# EAGLE design raspi3_nonHatv2 (EAGLE 9.4.1)
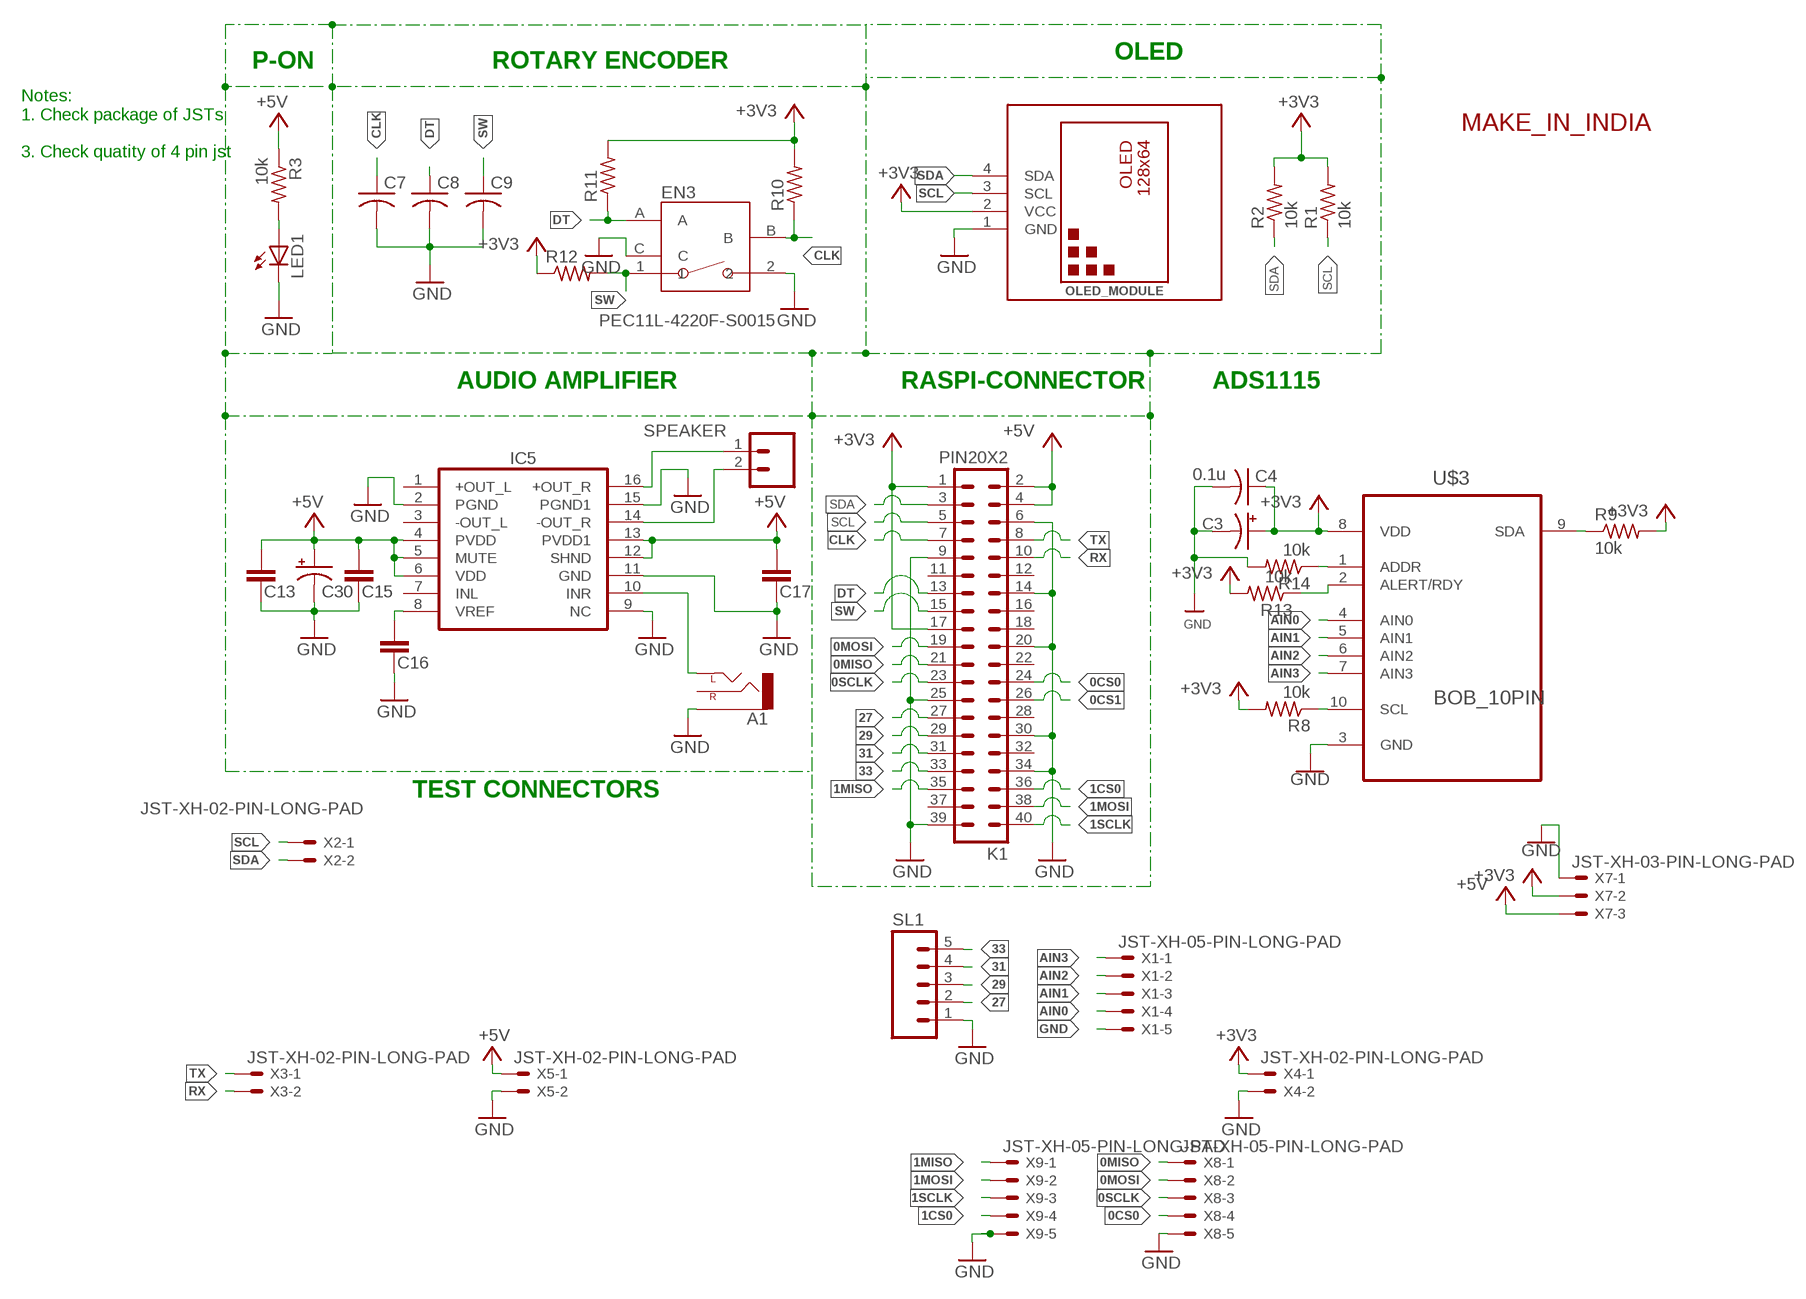
[diagram p0: schematic, sheet 1]

## Parts
A1  AUDIO-JACKPTH  [AUDIO-JACK]
C3  10u  CAP_POL_10V  [C/6032-28R]
C4  0.1u  CAP0805  [C0805]
C7  C-USC0603K  [C0603K]
C8  C-USC0603K  [C0603K]
C9  C-USC0603K  [C0603K]
C13  1uf  C-EUC1206  [C1206]
C15  1uf  C-EUC1206  [C1206]
C16  0.1uf  C-EUC1206  [C1206]
C17  1uf  C-EUC1206  [C1206]
C30  CAP_POL_10V  [C/6032-28R]
EN3  PEC11L-4220F-S0015  [PEC11L-4220F-S0015]
IC5  PAM8403  [SOP-16]
K1  PIN20X2  [PIN_20X2]
LED1  LED3MM  [LED3MM]
OLED_MODULE  DIY-MODULES_DISPLAY-OLED-128X64-I2C  [DIY-MODULES_DISPLAY-OLED-128X64-I2C]
R1  10k  RESISTOR0207/7  [0207/7]
R2  10k  RESISTOR0207/7  [0207/7]
R3  10k  RESISTOR0207/7  [0207/7]
R8  10k  RESISTOR0603  [R0603]
R9  10k  RESISTOR0603  [R0603]
R10  R-US_M0805  [M0805]
R11  R-US_M0805  [M0805]
R12  R-US_M0805  [M0805]
R13  10k  RESISTOR0603  [R0603]
R14  10k  RESISTOR0603  [R0603]
SL1  M05  [05P]
SPEAKER  M02  [02P]
U$1  MAKE-IN-INDIA-LOGO  [MAKE-IN-INDIA]
U$3  BOB_10PIN  [BOB10]
X1  JST-XH-05-PIN-LONG-PAD  [JST-XH-05-PACKAGE-LONG-PAD]
X2  JST-XH-02-PIN-LONG-PAD  [JST-XH-02-PACKAGE-LONG-PAD]
X3  JST-XH-02-PIN-LONG-PAD  [JST-XH-02-PACKAGE-LONG-PAD]
X4  JST-XH-02-PIN-LONG-PAD  [JST-XH-02-PACKAGE-LONG-PAD]
X5  JST-XH-02-PIN-LONG-PAD  [JST-XH-02-PACKAGE-LONG-PAD]
X7  JST-XH-03-PIN-LONG-PAD  [JST-XH-03-PACKAGE-LONG-PAD]
X8  JST-XH-05-PIN-LONG-PAD  [JST-XH-05-PACKAGE-LONG-PAD]
X9  JST-XH-05-PIN-LONG-PAD  [JST-XH-05-PACKAGE-LONG-PAD]

## Nets
0CS0: K1.24 X8.4
0CS1: K1.26
0MISO: K1.21 X8.1
0MOSI: K1.19 X8.2
0SCLK: K1.23 X8.3
1CS0: K1.36 X9.4
1MISO: K1.35 X9.1
1MOSI: K1.38 X9.2
1SCLK: K1.40 X9.3
27: K1.27 SL1.2
29: K1.29 SL1.3
31: K1.31 SL1.4
33: K1.33 SL1.5
+3V3: C3.+ C4.1 K1.1 K1.17 OLED_MODULE.2(VCC) R1.2 R2.2 R8.2 R9.2 R10.2 R11.2 R12.1 R13.2 U$3.8(VDD) X4.1 X7.2
+5V: C13.1 C15.2 C17.2 C30.+ IC5.4(PVDD) IC5.5(MUTE) IC5.6(VDD) IC5.12(SHND) IC5.13(PVDD1) K1.2 K1.4 R3.1 X5.1 X7.3
AIN0: U$3.4(AIN0) X1.4
AIN1: U$3.5(AIN1) X1.3
AIN2: U$3.6(AIN2) X1.2
AIN3: U$3.7(AIN3) X1.1
CLK: C7.1 EN3.B K1.7 R10.1
DT: C8.1 EN3.A K1.13 R11.1
GND: A1.SLEEVE C3.- C4.2 C7.2 C8.2 C9.2 C13.2 C15.1 C16.2 C17.1 C30.- EN3.2 EN3.C IC5.2(PGND) IC5.9(NC) IC5.11(GND) IC5.15(PGND1) K1.6 K1.9 K1.14 K1.20 K1.25 K1.30 K1.34 K1.39 LED1.K(C) OLED_MODULE.1(GND) R14.2 SL1.1 U$3.3(GND) X1.5 X4.2 X5.2 X7.1 X8.5 X9.5
N$1: LED1.A R3.2
N$4: IC5.16(+OUT_R) SPEAKER.1
N$12: R8.1 U$3.10(SCL)
N$13: R9.1 U$3.9(SDA)
N$14: R13.1 U$3.2(ALERT/RDY)
N$15: R14.1 U$3.1(ADDR)
N$27: IC5.14(-OUT_R) SPEAKER.2
N$29: A1.TIP(LEFT) IC5.10(INR)
N$34: C16.1 IC5.8(VREF)
RX: K1.10 X3.2
SCL: K1.5 OLED_MODULE.3(SCL) R1.1 X2.1
SDA: K1.3 OLED_MODULE.4(SDA) R2.1 X2.2
SW: C9.1 EN3.1 K1.15 R12.2
TX: K1.8 X3.1
Unconnected: A1.RING(RIGHT) IC5.1(+OUT_L) IC5.3(-OUT_L) IC5.7(INL) K1.11 K1.12 K1.16 K1.18 K1.22 K1.28 K1.32 K1.37

## Notes on the sheet
- OLED
- P-ON | ROTARY ENCODER
- Notes:
  1. Check package of JSTs
  
  3. Check quatity of 4 pin jst
- AUDIO AMPLIFIER | RASPI-CONNECTOR | ADS1115
- TEST CONNECTORS

## Library data of the parts
A1 = CEDT_JANUARY_2015_v5:AUDIO-JACK: 3.5mm Audio Jack Simple 3.5mm common PCB mount audio jack. SKU: PRT-08032
C3 = CEDT_JANUARY_2015_v5:CAP_POL
C4 = CEDT_JANUARY_2015_v5:CAP
C7-C9 = adafruit:C-US: CAPACITOR, American symbol
C13 C15-C17 = rcl:C-EU: CAPACITOR, European symbol
C30 = CEDT_SEPTEMBER_V2:CAP_POL
EN3 = Encoders:PEC11L-4220F-S0015: ROTARY ENCODER MECHANICAL 15PPR Manufacturer's datasheet <https://www.bourns.com/docs/Product-Datasheets/PEC11L.pdf>; CREATED_BY: PCBLayout.com; DIGIKEY_PARTNO: PEC11L-4220F-S0015-ND; MANUFACTURER: Bourns Inc.; MPN: PEC11L-4220F-S0015
IC5 = PAM8403:PAM8403: Dual channel audio amplifier IC - PAM8403
K1 = FLYFISH:PIN20X2
LED1 = CEDT_JANUARY_2015_v5:LED
OLED_MODULE = esp32_dev_kit_v14:DIY-MODULES_DISPLAY-OLED-128X64-I2C: 128x64 Dot Matrix OLED Module based on SSD1306 chip Variant with I2C interface More details available here: http://www.instructables.com/id/Monochrome-096-i2c-OLED-display-with-arduino-SSD13/ SSD1306 datasheet: https://cdn-shop.adafruit.com/datasheets/SSD1306.pdf Click here to find device on ebay.com <http://www.ebay.com/sch/oled+display+128x64+iic> Note: There are two variants: I2C and SPI. Search for the proper version.
R1-R3 = CEDT:RESISTOR; OC_FARNELL: unknown
R8 R9 R13 R14 = CEDT_JANUARY_2015_v5:RESISTOR
R10-R12 = rcl:R-US_: RESISTOR, American symbol; SPICEPREFIX: R
SL1 = con-amp-quick:M05: AMP QUICK CONNECTOR; OC_FARNELL: unknown; OC_NEWARK: unknown
SPEAKER = CEDT_JANUARY_2015_v5:M02: AMP QUICK CONNECTOR
U$1 = namanpuri:MAKE-IN-INDIA-LOGO
U$3 = CEDT_JANUARY_2015_v5:BOB_10PIN
X1 X8 X9 = Rembrandt Electronics - JST XH Connectors v1-0:JST-XH-05-PIN: JST XH Connector 2 Pin Wire to board connector. Pitch: 2,54 mm, (0.100") Number of pins: 5 Created by Rembrandt Electronics www.rembrandtelectronics.com
X2-X5 = Rembrandt Electronics - JST XH Connectors v1-0:JST-XH-02-PIN: JST XH Connector 2 Pin Wire to board connector. Pitch: 2,54 mm, (0.100") Number of pins: 2 Created by Rembrandt Electronics www.rembrandtelectronics.com
X7 = Rembrandt Electronics - JST XH Connectors v1-0:JST-XH-03-PIN: JST XH Connector 2 Pin Wire to board connector. Pitch: 2,54 mm, (0.100") Number of pins: 3 Created by Rembrandt Electronics www.rembrandtelectronics.com

## Board
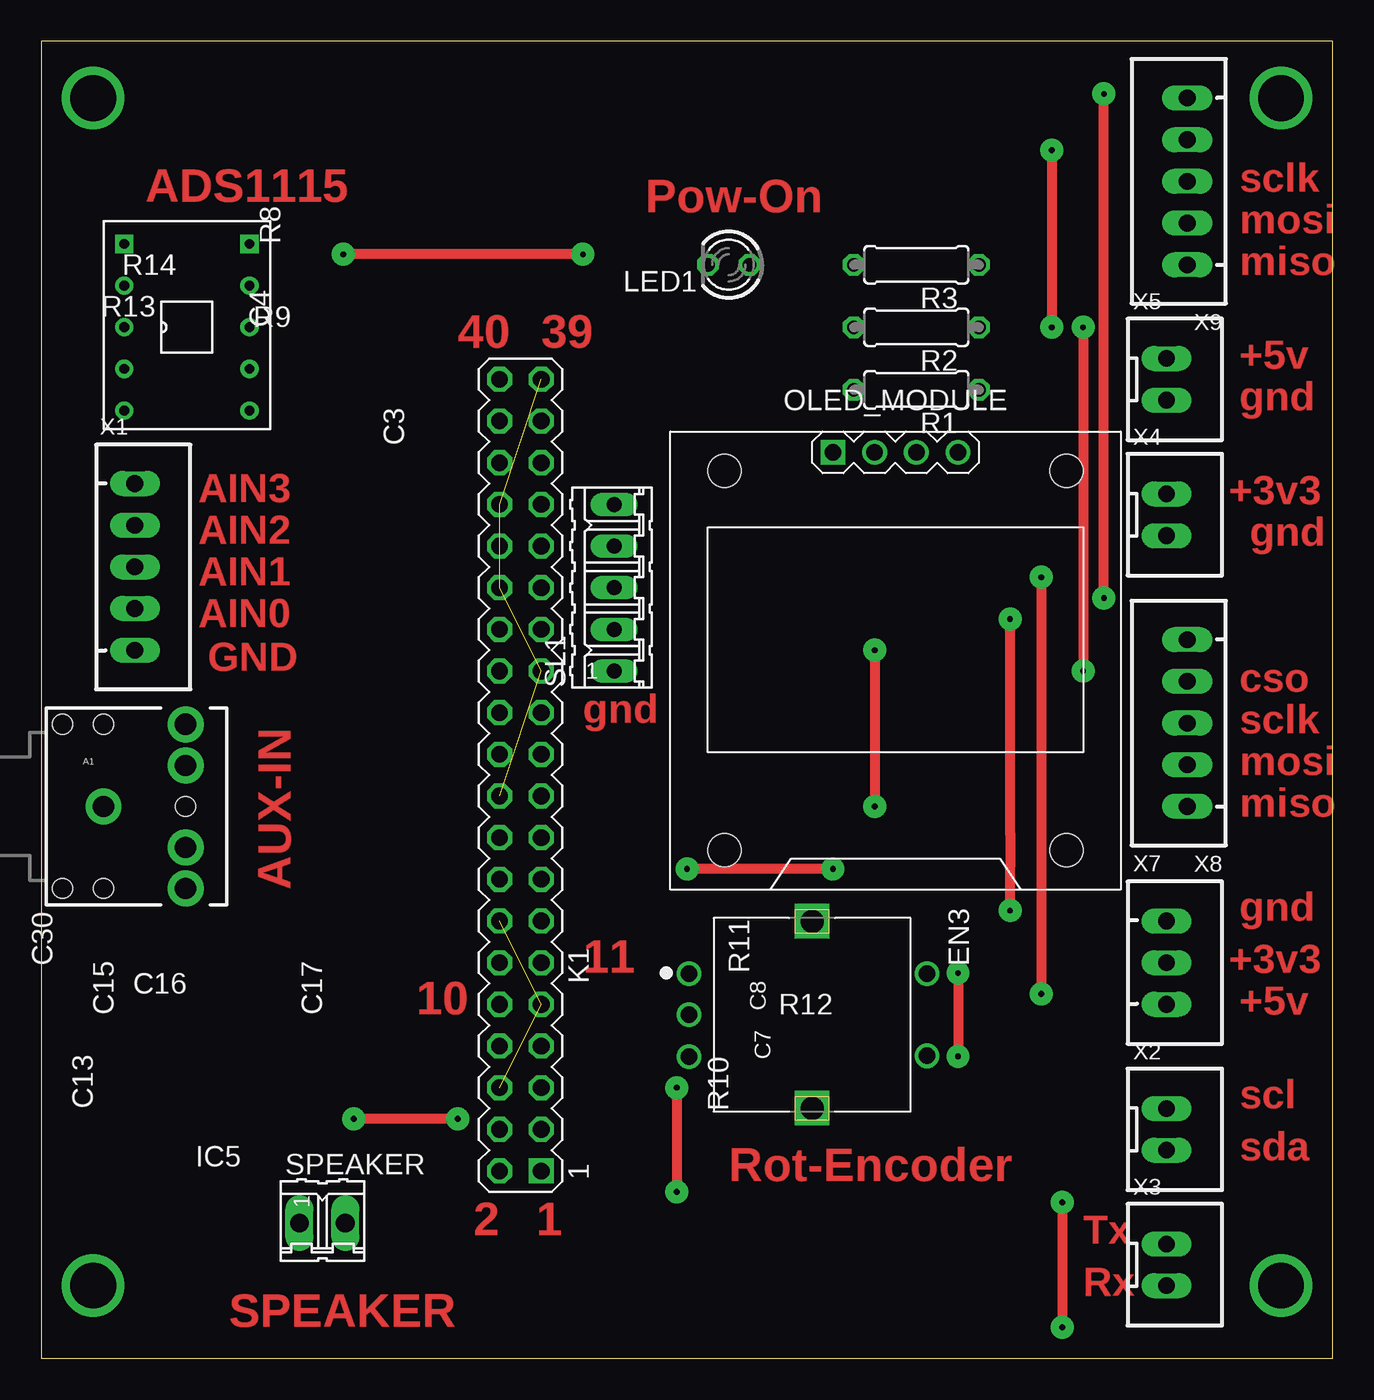
[diagram p1: board, top side]
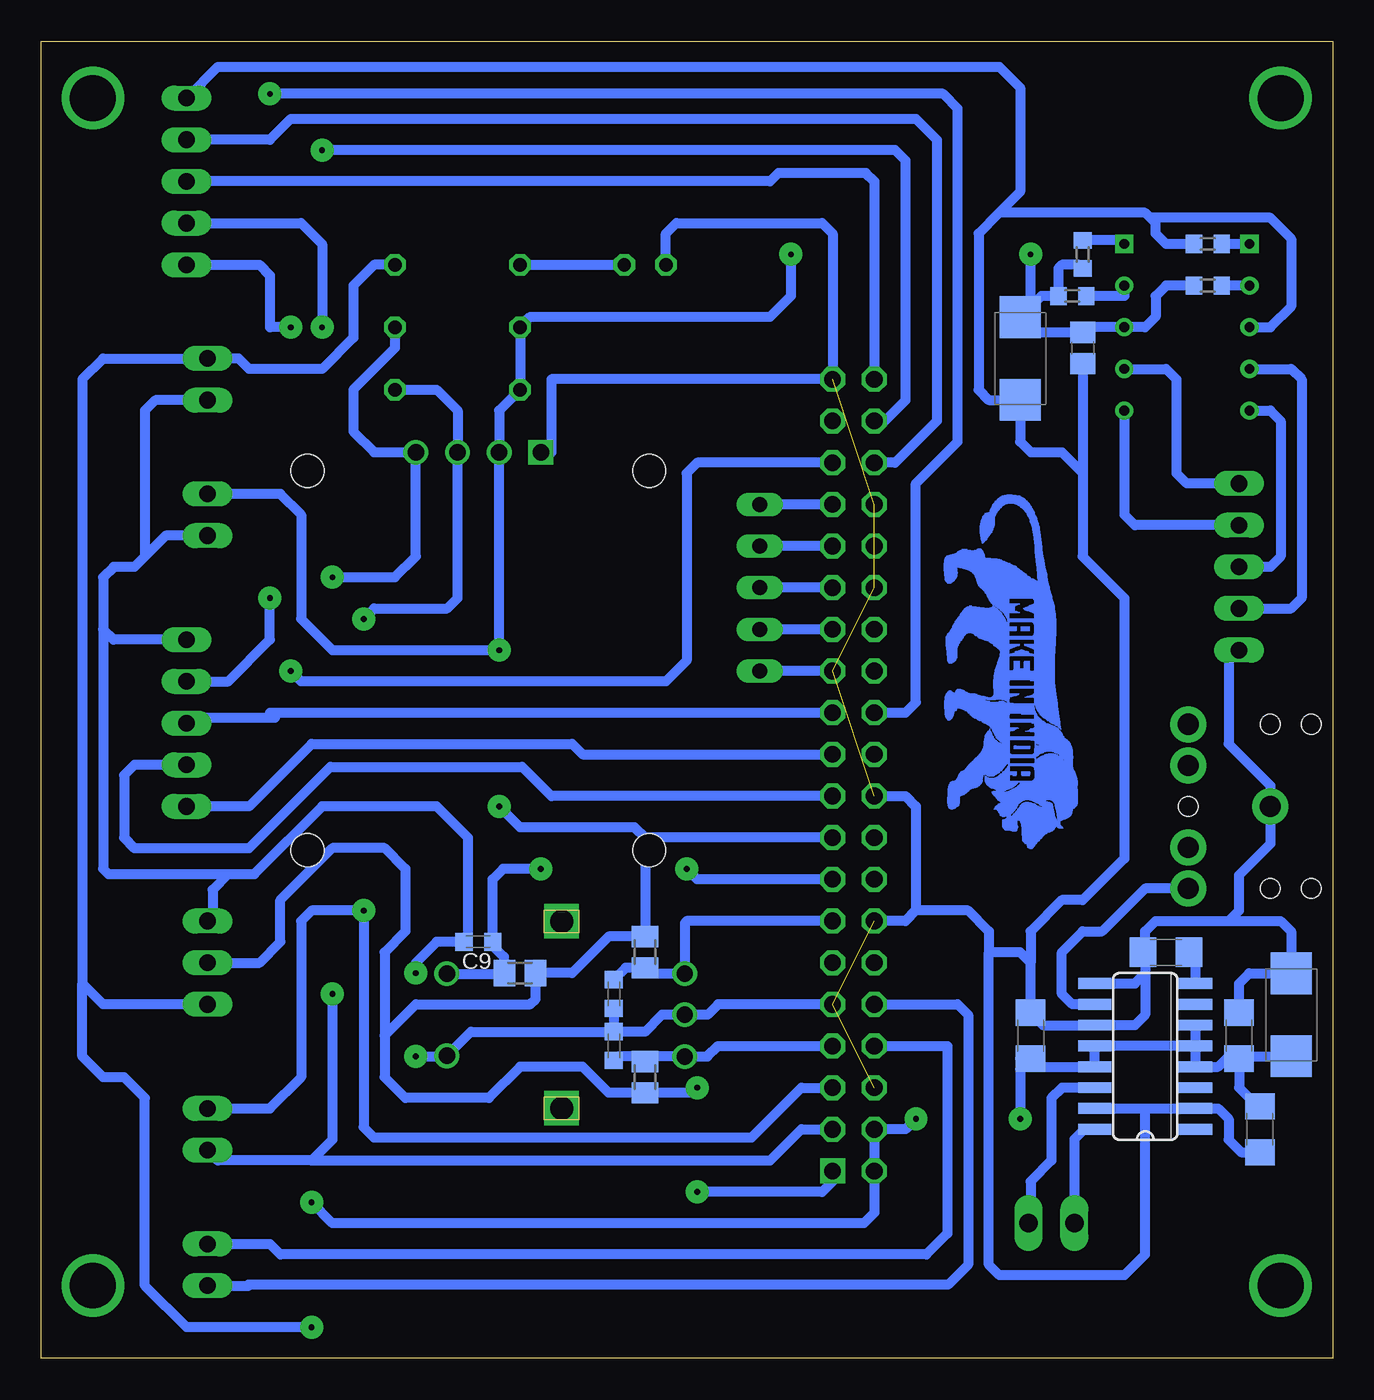
[diagram p2: board, bottom side, seen from below]

Size 78.72 x 80.31 mm. Coordinates in mm from the lower left corner, seen from the top.
Outline: 0,0 78.72,0 78.72,80.31 0,80.31 0,0
Copper layers (1*16): Top 0.035mm / dielectric 1.5mm / Bottom 0.035mm
Design rules "default": minimum track width 6mil, minimum drill 0.35mm, track to track 6mil, track to pad 6mil, pad to pad 6mil, via to via 6mil, smd to smd 6mil, copper to edge 40mil, drill to drill 6mil, minimum pad ring 10mil, minimum via ring 8mil, stop-mask expansion 4mil, vias tented up to drill 0mil, thermal gap 10mil

### Footprints (pad centres in the part's own frame; a part is rotated, then mirrored left to right if it is on the bottom)
AUDIO-JACK = drill 1.3 pad 2.184: RING 5,5; RSH 5,2.5; SLEEVE 0,0; TIP 5,-5; TSH 5,-2.5 | hole 1.2: 0,5; -2.5,5; -2.5,-5; 0,-5; 5,0
C/6032-28R = smd 2.55 x 2.5: + 2.525,0; - -2.525,0
C0805 = smd 1.3 x 1.5: 1 -0.95,0; 2 0.95,0
C0603K = smd 1.05 x 1.08: 1 -0.875,0; 2 0.875,0
C1206 = smd 1.6 x 1.8: 1 -1.4,0; 2 1.4,0
PEC11L-4220F-S0015 = drill 1: 1 -2.5,7; 2 2.5,7; A -2.5,-7.5; B 2.55,-7.5; C 0,-7.5 | drill 1.4 square: M1 -5.7,0; M2 5.7,0
SOP-16 = smd 0.66 x 2.032: 1 -4.445,-3.073; 2 -3.175,-3.073; 3 -1.905,-3.073; 4 -0.635,-3.073; 5 0.635,-3.073; 6 1.905,-3.073; 7 3.175,-3.073; 8 4.445,-3.073; 9 4.445,3.073; 10 3.175,3.073; 11 1.905,3.073; 12 0.635,3.073; 13 -0.635,3.073; 14 -1.905,3.073; 15 -3.175,3.073; 16 -4.445,3.073
PIN_20X2 = drill 1.016 square: 1 -24.13,-1.27 | drill 1.016 octagon: 2 -24.13,1.27; 3 -21.59,-1.27; 4 -21.59,1.27; 5 -19.05,-1.27; 6 -19.05,1.27; 7 -16.51,-1.27; 8 -16.51,1.27; 9 -13.97,-1.27; 10 -13.97,1.27; 11 -11.43,-1.27; 12 -11.43,1.27; 13 -8.89,-1.27; 14 -8.89,1.27; 15 -6.35,-1.27; 16 -6.35,1.27; 17 -3.81,-1.27; 18 -3.81,1.27; 19 -1.27,-1.27; 20 -1.27,1.27; 21 1.27,-1.27; 22 1.27,1.27; 23 3.81,-1.27; 24 3.81,1.27; 25 6.35,-1.27; 26 6.35,1.27; 27 8.89,-1.27; 28 8.89,1.27; 29 11.43,-1.27; 30 11.43,1.27; 31 13.97,-1.27; 32 13.97,1.27; 33 16.51,-1.27; 34 16.51,1.27; 35 19.05,-1.27; 36 19.05,1.27; 37 21.59,-1.27; 38 21.59,1.27; 39 24.13,-1.27; 40 24.13,1.27
LED3MM = drill 0.813 octagon: A -1.27,0; K 1.27,0
DIY-MODULES_DISPLAY-OLED-128X64-I2C = drill 1 square: 1 -3.81,12.7 | drill 1: 2 -1.27,12.7; 3 1.27,12.7; 4 3.81,12.7 | hole 2: -10.414,11.557; 10.414,11.557; 10.414,-11.557; -10.414,-11.557
0207/7 = drill 0.813 octagon: 1 -3.81,0; 2 3.81,0
R0603 = smd 1 x 1.1: 1 -0.85,0; 2 0.85,0
M0805 = smd 1.3 x 1.6: 1 -0.95,0; 2 0.95,0
05P = drill 0.914 long: 1 -5.08,0; 2 -2.54,0; 3 0,0; 4 2.54,0; 5 5.08,0
02P = drill 1.143 long: 1 -1.397,0; 2 1.397,0
BOB10 = drill 0.6 square: 1 -3.81,5.08; 10 3.81,5.08 | drill 0.6: 2 -3.81,2.54; 3 -3.81,0; 4 -3.81,-2.54; 5 -3.81,-5.08; 6 3.81,-5.08; 7 3.81,-2.54; 8 3.81,0; 9 3.81,2.54
JST-XH-05-PACKAGE-LONG-PAD = drill 1.016 long: 1 -5.08,0; 2 -2.54,0; 3 0,0; 4 2.54,0; 5 5.08,0
JST-XH-02-PACKAGE-LONG-PAD = drill 1.016 long: 1 -1.27,0; 2 1.27,0
JST-XH-03-PACKAGE-LONG-PAD = drill 1.016 long: 1 -2.54,0; 2 0,0; 3 2.54,0

### Placement (x,y rotation side)
A1  3.81,33.66 0 top
C3  19.05,60.96 90 bottom
C4  15.24,61.59 270 bottom
C7  43.81,19.05 90 bottom
C8  43.81,22.23 270 bottom
C9  52.07,25.4 180 bottom
C13  4.45,13.97 270 bottom
C15  5.71,19.68 270 bottom
C16  10.16,24.77 180 bottom
C17  18.41,19.68 270 bottom
C30  2.54,20.95 270 bottom
EN3  46.99,20.95 270 top
IC5  11.43,18.41 90 bottom
K1  29.21,35.56 90 top
LED1  41.91,66.67 180 top
OLED_MODULE  52.07,42.55 0 top
R1  53.34,59.05 180 top
R2  53.34,62.87 180 top
R3  53.34,66.67 180 top
R8  15.24,67.31 270 bottom
R9  15.88,64.77 180 bottom
R10  41.91,17.14 270 bottom
R11  41.91,24.77 90 bottom
R12  49.53,23.5 180 bottom
R13  7.62,65.41 180 bottom
R14  7.62,67.94 180 bottom
SL1  34.92,46.99 90 top
SPEAKER  17.14,8.26 0 top
U$1  23.5,32.38 90 top
U$3  8.89,62.87 0 top
X1  5.71,48.26 270 top
X2  68.58,13.97 270 top
X3  68.58,5.71 270 top
X4  68.58,51.44 270 top
X5  68.58,59.69 270 top
X7  68.58,24.13 270 top
X8  69.85,38.73 90 top
X9  69.85,71.75 90 top

### Tracks (layer width: path | path; a pad name or v marks a point on that pad's centre or on a via)
0CS0  (via drill 0.35 pad 1.4)
  Top 0.61: v64.77,46.35 v64.77,77.09
  Bottom 0.61: v64.77,77.09 23.75,77.09 22.86,76.2 22.86,55.88 25.4,53.34 25.4,40.01 26.04,39.37 K1.24 | X8.4 67.31,41.27 64.77,43.81 v64.77,46.35
0MISO
  Bottom 0.61: K1.21 45.72,36.83 46.35,37.47 62.23,37.47 66.04,33.66 X8.1
0MOSI
  Bottom 0.61: K1.19 47.62,34.29 49.4,36.07 61.09,36.07 66.04,31.11 73.03,31.11 73.66,31.75 73.66,35.56 73.03,36.2 X8.2
0SCLK
  Bottom 0.61: K1.23 64.77,39.37 64.45,39.05 69.53,39.05 X8.3
1CS0
  Bottom 0.61: K1.36 26.67,54.61 24.13,57.15 24.13,74.3 25.4,75.56 63.5,75.56 64.77,74.3 X9.4
1MISO  (via drill 0.35 pad 1.4)
  Top 0.61: v63.5,62.87 v63.5,41.91
  Bottom 0.61: v63.5,41.91 62.87,41.27 40.64,41.27 39.37,42.55 39.37,53.98 38.73,54.61 K1.35 | v63.5,62.87 64.77,62.87 64.77,66.04 65.41,66.67 X9.1
1MOSI  (via drill 0.35 pad 1.4)
  Top 0.61: v61.59,73.66 v61.59,62.87
  Bottom 0.61: K1.38 27.3,57.15 26.04,58.42 26.04,73.03 26.67,73.66 v61.59,73.66 | v61.59,62.87 61.59,67.94 62.87,69.22 X9.2
1SCLK
  Bottom 0.61: K1.40 27.94,71.75 28.45,72.26 33.78,72.26 34.29,71.75 X9.3
27
  Bottom 0.61: K1.27 SL1.2
29
  Bottom 0.61: K1.29 SL1.3
31
  Bottom 0.61: K1.31 SL1.4
33
  Bottom 0.61: K1.33 SL1.5
+3V3  (via drill 0.35 pad 1.4)
  Top 0.61: v33.02,67.31 v18.41,67.31 | v50.8,43.18 v50.8,33.66 | v38.73,16.51 v38.73,10.16
  Bottom 0.61: 30.53,11.48 K1.1 30.48,10.79 31.11,10.16 v38.73,10.16 | C3.+ 19.05,62.87 | R13.2 10.16,65.41 10.79,64.77 10.79,63.5 11.43,62.87 U$3.8 14.92,62.87 C4.1 18.11,62.55 C3.+ | R8.2 15.46,66.67 16.51,66.67 16.73,66.46 R9.2 | 16.51,64.98 R9.2 | 18.41,64.12 v18.41,67.31 | v33.02,67.31 33.02,64.77 34.29,63.5 48.9,63.5 R2.2 R1.2 50.8,57.78 OLED_MODULE.2 v50.8,43.18 60.96,43.18 62.87,45.09 62.87,51.44 64.14,52.7 X4.1 | 57.78,19.68 55.88,21.59 48.9,21.59 48.58,21.91 R12.1 46.35,23.5 44.13,25.71 R11.2 41.91,31.75 | v50.8,33.66 49.53,32.38 42.55,32.38 41.91,31.75 | K1.17 41.91,31.75 | 57.78,19.68 57.78,24.77 56.52,26.04 56.52,29.84 57.78,31.11 60.96,31.11 64.14,27.94 64.14,25.4 65.41,24.13 X7.2 | 57.78,19.68 57.78,17.14 56.52,15.88 51.44,15.88 49.53,17.78 45.72,17.78 44.13,16.2 R10.2 39.05,16.2 v38.73,16.51 | C3.+ 18.41,64.12 | R9.2 17.77,64.77 18.41,64.12
+5V  (via drill 0.35 pad 1.4)
  Top 0.61: v62.23,9.53 v62.23,1.91 | v25.4,14.61 v19.05,14.61
  Bottom 0.61: IC5.5 IC5.4 6.99,17.78 6.35,18.41 5.84,18.41 C15.2 | C15.2 5.57,18.43 C30.+ | C17.2 18,17.87 17.65,17.78 IC5.13 IC5.12 IC5.5 | C17.2 19.05,18.29 | R3.1 58.42,66.67 59.69,65.41 59.69,62.23 61.59,60.33 66.04,60.33 66.67,60.96 X5.1 74.93,60.96 76.2,59.69 76.2,22.86 | v62.23,9.53 60.96,8.26 28.57,8.26 27.94,8.89 K1.2 K1.4 26.04,13.97 v25.4,14.61 | v62.23,1.91 69.85,1.91 72.39,4.45 72.39,15.88 73.66,17.14 74.93,17.14 76.2,18.41 76.2,22.86 | C17.2 17.91,17.78 | C17.2 19.05,17.65 v19.05,14.61 | IC5.5 IC5.6 | C15.2 5.71,16.51 4.58,15.37 C13.1 | 76.2,22.86 74.93,21.59 X7.3
AIN0
  Bottom 0.61: U$3.4 2.54,60.33 1.91,59.69 1.91,46.35 2.54,45.72 X1.4
AIN1
  Bottom 0.61: U$3.5 3.81,57.78 3.17,57.15 3.17,48.9 3.81,48.26 X1.3
AIN2
  Bottom 0.61: U$3.6 12.7,51.44 12.06,50.8 X1.2
AIN3
  Bottom 0.61: U$3.7 10.16,60.33 9.53,59.69 9.53,53.98 8.89,53.34 X1.1
CLK
  Bottom 0.61: 42.22,18.41 EN3.B 38.11,18.41 37.47,19.05 K1.7 | 42.22,18.41 43.59,18.41 C7.1 | R10.1 42.22,18.41
DT
  Bottom 0.61: K1.13 39.37,26.67 39.49,26.55 EN3.A 41.55,23.45 R11.1 43.1,23.82 C8.1
GND  (via drill 0.35 pad 1.4)  (6 unrouted)
  Top 0.61: v55.88,23.5 v55.88,18.41
  Bottom 0.61: C15.1 5.71,22.86 5.09,23.48 C30.- 2.54,26.04 3.17,26.67 6.35,26.67 | IC5.15 11.43,15.24 | 11.43,15.24 IC5.2 | 6.35,26.67 10.79,26.67 11.43,26.04 11.43,24.89 C16.2 11.43,24.64 11.43,23.5 | C8.2 C7.2 | C7.2 41.91,19.93 40.88,20.95 EN3.C 38.1,20.95 37.47,21.59 K1.9 | C7.2 52.52,19.93 EN3.2 54.03,18.41 v55.88,18.41 | R14.2 10.16,67.94 10.79,68.58 10.79,69.22 11.11,69.53 | 11.11,69.53 11.43,69.85 20.32,69.85 | U$3.3 3.81,62.87 2.54,64.14 2.54,68.26 3.81,69.53 11.11,69.53 | 20.01,57.48 C3.- | 20.32,69.85 21.59,68.58 21.59,59.05 20.97,58.44 C3.- | 11.43,23.5 11.43,20.95 12.06,20.32 IC5.11 17.65,20.32 C17.1 18.41,24.13 | 7.62,15.24 IC5.2 | 11.43,15.24 11.43,6.35 12.7,5.08 20.32,5.08 20.95,5.71 20.95,24.77 | 18.41,24.13 19.05,24.77 20.95,24.77 | OLED_MODULE.1 47.62,55.24 47.62,59.69 K1.39 30.48,68.58 31.11,69.22 40.01,69.22 40.64,68.58 LED1.K | v55.88,23.5 55.88,24.13 54.61,25.4 C9.2 52.7,25.64 52.7,31.75 54.61,33.66 61.59,33.66 65.72,29.53 67.31,29.53 | 6.35,26.67 5.73,27.29 5.73,29.45 3.81,31.37 A1.SLEEVE 3.81,34.92 6.35,37.47 6.35,42.55 X1.5 | 19.05,58.74 C3.- | C4.2 15.24,53.98 | 15.24,53.98 15.24,48.9 12.7,46.35 12.7,30.48 15.24,27.94 16.51,27.94 18.41,26.04 18.41,24.13 | K1.20 26.04,34.29 25.4,33.66 25.4,27.3 | 72.39,48.9 72.39,57.78 71.75,58.42 X5.2 | 72.39,48.9 71.12,50.16 X4.2 | 72.39,48.9 73.03,48.26 74.3,48.26 74.93,47.62 74.93,44.45 | C3.- 19.05,55.9 18.4,55.24 16.51,55.24 15.24,53.98 | K1.25 SL1.1 | K1.14 26.04,26.67 25.4,27.3 | 25.4,27.3 22.23,27.3 20.95,26.04 20.95,24.77 | IC5.2 6.99,15.24 6.35,14.61 6.35,13.34 5.58,12.57 C13.2 | IC5.9 12.06,22.86 11.43,23.5 | 68.26,26.99 X7.1
  Bottom 0.61: 69.53,26.99 68.26,26.99 | 67.31,29.53 68.26,28.57 68.26,26.99 | 74.93,44.45 74.93,29.84 74.61,29.53 67.31,29.53 | X8.5 74.3,43.81 74.93,44.45 | 20.32,69.85 19.05,71.12 19.05,77.47 20.32,78.74 67.94,78.74 X9.5
N$1
  Bottom 0.61: R3.2 LED1.A
N$3  (via drill 2.79 pad 3.81)
  other vias: 3.17,76.83
N$4
  Bottom 0.61: IC5.16 15.14,13.97 15.75,13.36 SPEAKER.1
N$5  (via drill 2.79 pad 3.81)
  other vias: 75.56,76.83
N$6  (via drill 2.79 pad 3.81)
  other vias: 75.56,4.45
N$7  (via drill 2.79 pad 3.81)
  other vias: 3.17,4.45
N$12
  Bottom 0.61: U$3.10 12.91,68.16 R8.1
N$13
  Bottom 0.61: U$3.9 12.7,64.77 R9.1
N$14
  Bottom 0.61: U$3.2 R13.1
N$15
  Bottom 0.61: U$3.1 R14.1
N$27
  Bottom 0.61: IC5.14 16.51,16.51 17.14,15.88 17.14,12.06 18.41,10.79 18.41,8.38 SPEAKER.2
N$29
  Bottom 0.61: IC5.10 15.88,21.59 16.51,22.23 16.51,24.77 15.24,26.04 14.05,26.04 11.43,28.66 A1.TIP
N$34
  Bottom 0.61: IC5.8 8.36,24.36 C16.1
RX
  Bottom 0.61: K1.10 22.86,21.59 22.23,20.95 22.23,5.71 23.44,4.5 66.09,4.5 66.04,4.45 X3.2
SCL  (via drill 0.35 pad 1.4)
  Top 0.61: v59.05,27.3 59.05,29.99 59.09,30.03 59.09,31.95 59.05,31.98 v59.05,45.09
  Bottom 0.61: R1.1 54.61,59.05 53.34,57.78 OLED_MODULE.3 53.34,46.35 53.98,45.72 58.42,45.72 v59.05,45.09 | K1.5 32.38,16.51 35.43,13.46 58.42,13.46 59.05,14.1 v59.05,27.3 62.23,27.3 62.87,26.67 62.87,17.14 64.77,15.24 X2.1
SDA  (via drill 0.35 pad 1.4)
  Top 0.61: v60.96,47.62 v60.96,22.23
  Bottom 0.61: R2.1 57.15,61.59 59.69,59.05 59.69,56.52 58.42,55.24 OLED_MODULE.4 55.88,48.9 57.15,47.62 v60.96,47.62 | K1.3 32.38,13.97 34.29,12.06 62.23,12.06 | v60.96,22.23 60.96,13.34 62.23,12.06 | X2.2 67.94,12.06 62.23,12.06
SW  (via drill 0.35 pad 1.4)
  Top 0.61: v48.26,29.84 v39.37,29.84
  Bottom 0.61: EN3.1 50.52,23.45 | 50.52,23.45 R12.2 | 50.52,23.45 50.52,24.48 51.2,25.16 C9.1 51.2,29.21 50.56,29.84 v48.26,29.84 | v39.37,29.84 38.73,29.21 K1.15
TX
  Bottom 0.61: K1.8 23.5,19.05 23.5,7.62 24.77,6.35 64.14,6.35 64.77,6.99 X3.1

### Text on the board
Top: sclk | ADS1115 | Pow-On | mosi | miso | 40 | 39 | +5v | gnd | AIN3 | +3v3 | AIN2 | gnd | AIN1 | AIN0 | GND | cso | gnd | sclk | mosi | miso | AUX-IN | gnd | 11 | +3v3 | 10 | +5v | scl | sda | Rot-Encoder | 2 | 1 | Tx | Rx | SPEAKER